# EAGLE design AMP 2.0 Single Channel (EAGLE 6.5.0)
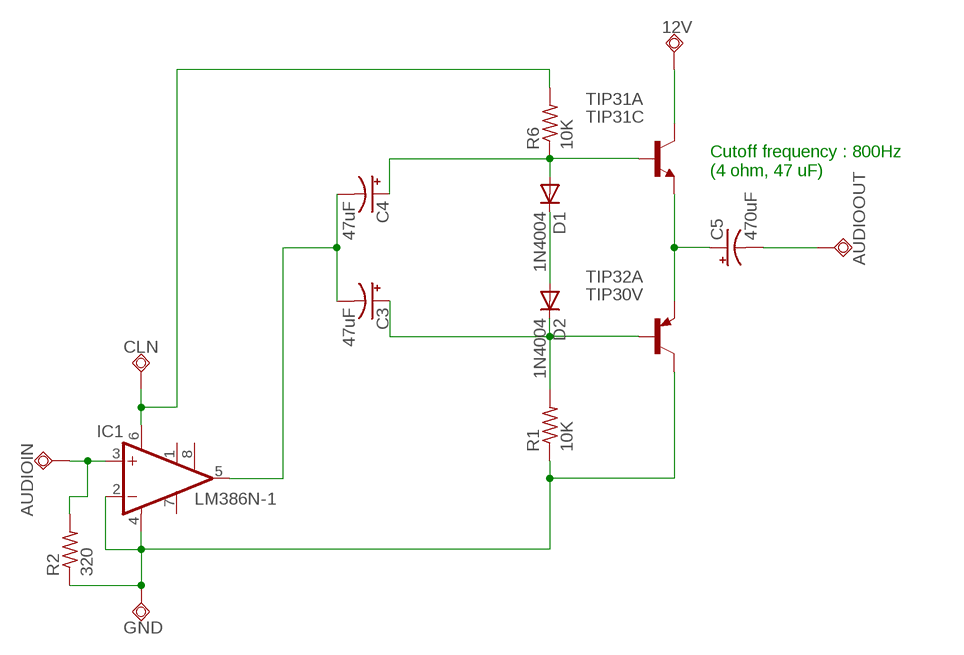
[diagram p0: schematic, sheet 1]

## Parts
12V  TPSQPAD1-20  [P1-20]
AUDIOIN  TPSQPAD1-20  [P1-20]
AUDIOOUT  TPSQPAD1-20  [P1-20]
C3  47uF  CPOL-USE5-4  [E5-4]
C4  47uF  CPOL-USE5-4  [E5-4]
C5  470uF  CPOL-USE5-4  [E5-4]
CLN  TPSQPAD1-20  [P1-20]
D1  1N4004  [DO41-10]
D2  1N4004  [DO41-10]
GND  TPSQPAD1-20  [P1-20]
IC1  LM386N-1  [DIL08]
R1  10K  R-US_0204/7  [0204/7]
R2  320  R-US_0204/7  [0204/7]
R6  10K  R-US_0204/7  [0204/7]
TIP31A  TIP31C  [TO220V]
TIP32A  TIP30V  [TO220V]

## Nets
AALFT: C3.- C4.- IC1.5(OUT)
ALFT: AUDIOIN.TP IC1.3(+IN) R2.2
AULEFT: AUDIOOUT.TP C5.-
CLEANPWR: C4.+ D1.A R6.1 TIP31A.1(B)
GND [Power]: GND.TP IC1.2(-IN) IC1.4(GND) R1.1 R2.1 TIP32A.2(C)
N$1: D1.C D2.A
N$2: C3.+ D2.C R1.2 TIP32A.1(B)
N$3 [Cleanpower]: CLN.TP IC1.6(VS) R6.2
N$4: C5.+ TIP31A.3(E) TIP32A.3(E)
N$6: 12V.TP TIP31A.2(C)
Unconnected: IC1.1(GAIN) IC1.7(BYPASS) IC1.8(GAIN)

## Notes on the sheet
- Cutoff frequency : 800Hz
  (4 ohm, 47 uF)

## Library data of the parts
12V AUDIOIN AUDIOOUT CLN GND = testpad:TPSQ: Test pad
C3-C5 = rcl:CPOL-US: POLARIZED CAPACITOR, American symbol
D1 D2 = diode:1N4004: DIODE general purpose rectifier, 1 A
IC1 = linear:LM386?-*: Low Voltage Audio Power Amplifier Source: http://cache.national.com/ds/LM/LM386.pdf
R1 R2 R6 = rcl:R-US_: RESISTOR, American symbol
TIP31A = transistor-npn:TIP31C*: NPN Transistor
TIP32A = transistor-pnp:TIP30: PNP Transistor

## Net classes
0 Signal: width 0.61 mm, clearance 0.762 mm
1 Power: width 1.27 mm, clearance 0.762 mm
2 Cleanpower: width 0.61 mm, clearance 0.762 mm

## Board
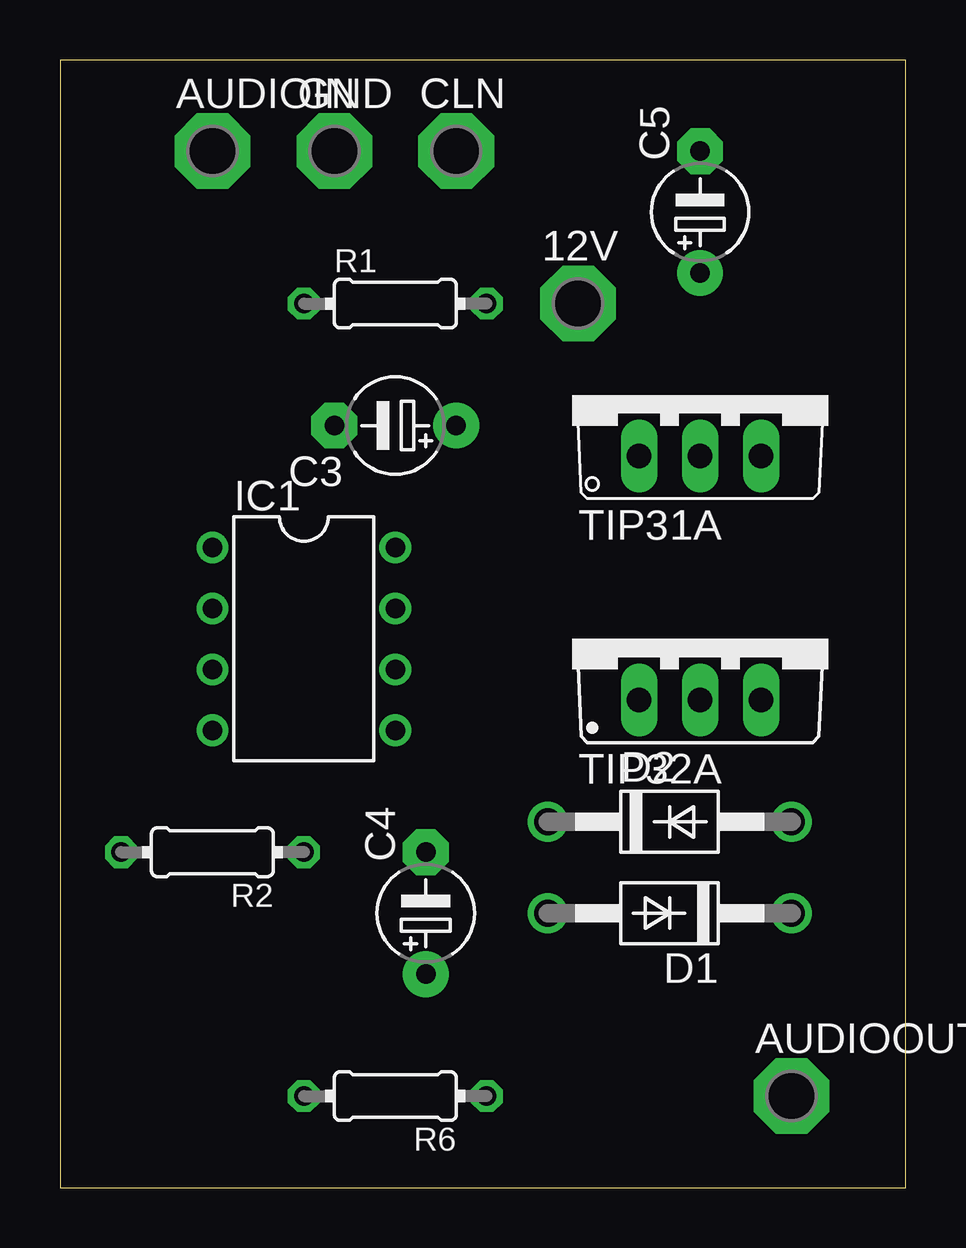
[diagram p1: board, top side]
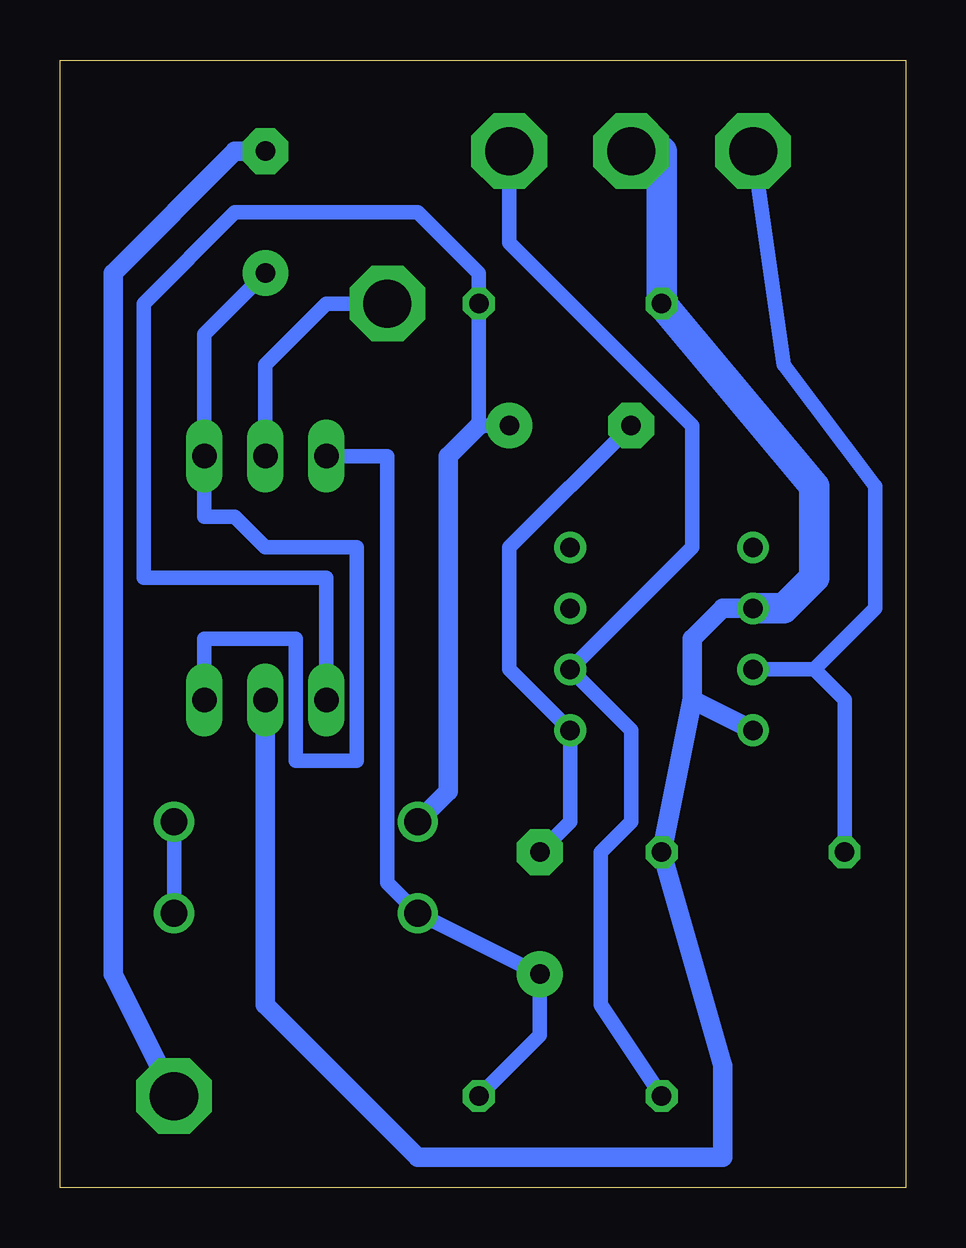
[diagram p2: board, bottom side, seen from below]

Size 35.23 x 46.98 mm. Coordinates in mm from the lower left corner, seen from the top.
Outline: 0,0 35.23,0 35.23,46.98 0,46.98 0,0
Copper layers (1*16): Top 0.035mm / dielectric 1.5mm / Bottom 0.035mm
Design rules "default": minimum track width 10mil, minimum drill 24mil, track to track 8mil, track to pad 8mil, pad to pad 8mil, via to via 8mil, smd to smd 8mil, copper to edge 40mil, drill to drill 8mil, minimum pad ring 10mil, minimum via ring 8mil, stop-mask expansion 4mil, vias tented up to drill 0mil, thermal gap 10mil

### Footprints (pad centres in the part's own frame; a part is rotated, then mirrored left to right if it is on the bottom)
P1-20 = drill 2.007 pad 3.15 octagon: TP 0,0
E5-4 = drill 0.813 pad 1.905: + -2.54,0 | drill 0.813 pad 1.905 octagon: - 2.54,0
DO41-10 = drill 1.118: A 5.08,0; C -5.08,0
DIL08 = drill 0.813 pad 1.27: 1 -3.81,-3.81; 2 -1.27,-3.81; 3 1.27,-3.81; 4 3.81,-3.81; 5 3.81,3.81; 6 1.27,3.81; 7 -1.27,3.81; 8 -3.81,3.81
0204/7 = drill 0.813 octagon: 1 -3.81,0; 2 3.81,0
TO220V = drill 1.016 long: 1 -2.54,-2.54; 2 0,-2.54; 3 2.54,-2.54

### Placement (x,y rotation side)
12V  21.59,36.83 0 top
AUDIOIN  6.35,43.18 0 top
AUDIOOUT  30.48,3.81 0 top
C3  13.97,31.75 180 top
C4  15.24,11.43 90 top
C5  26.67,40.64 90 top
CLN  16.51,43.18 0 top
D1  25.4,11.43 180 top
D2  25.4,15.24 0 top
GND  11.43,43.18 0 top
IC1  10.16,22.86 270 top
R1  13.97,36.83 0 top
R2  6.35,13.97 180 top
R6  13.97,3.81 180 top
TIP31A  26.67,33.02 0 top
TIP32A  26.67,22.86 0 top

### Tracks (layer width: path | path; a pad name or v marks a point on that pad's centre or on a via)
AALFT
  Bottom 0.61: C4.- 13.97,15.24 IC1.5 16.51,21.59 16.51,26.67 C3.-
ALFT
  Bottom 0.61: AUDIOIN.TP 5.08,34.29 1.27,29.21 1.27,24.13 3.81,21.59 | 3.81,21.59 IC1.3 | R2.2 2.54,20.32 3.81,21.59
AULEFT
  Bottom 0.813: C5.- 27.94,43.18 33.02,38.1 33.02,8.89 AUDIOOUT.TP
CLEANPWR
  Bottom 0.61: R6.1 15.24,6.35 C4.+ D1.A 21.59,12.7 21.59,30.48 TIP31A.1
GND
  Bottom 0.813: IC1.2 7.62,24.13 8.89,22.86 8.89,20.32 | IC1.4 8.89,20.32 | 8.89,20.32 R2.1 7.62,5.08 7.62,1.27 20.32,1.27 26.67,7.62 TIP32A.2
  Bottom 1.27: GND.TP 10.16,43.18 R1.1 3.81,29.21 3.81,25.4 5.08,24.13 IC1.2
N$1
  Bottom 0.61: D2.A D1.C
N$2
  Bottom 0.61: C3.+ 17.78,31.75 R1.2 17.78,38.1 20.32,40.64 27.94,40.64 31.75,36.83 31.75,25.4 24.13,25.4 TIP32A.1
  Bottom 0.813: D2.C 19.05,16.51 19.05,30.48 17.78,31.75
N$3
  Bottom 0.61: R6.2 12.7,7.62 12.7,13.97 11.43,15.24 11.43,19.05 IC1.6 8.89,26.67 8.89,31.75 16.51,39.37 CLN.TP
N$4
  Bottom 0.61: C5.+ 29.21,35.56 TIP31A.3 29.21,27.94 27.94,27.94 26.67,26.67 22.86,26.67 22.86,17.78 25.4,17.78 25.4,22.86 29.21,22.86 TIP32A.3
N$6
  Bottom 0.61: 12V.TP 24.13,36.83 26.67,34.29 TIP31A.2